# Altium schematic sheet SOC Power.SchDoc
size A2; DocumentNumber: 2; SheetNumber: 3; SheetTotal: 14
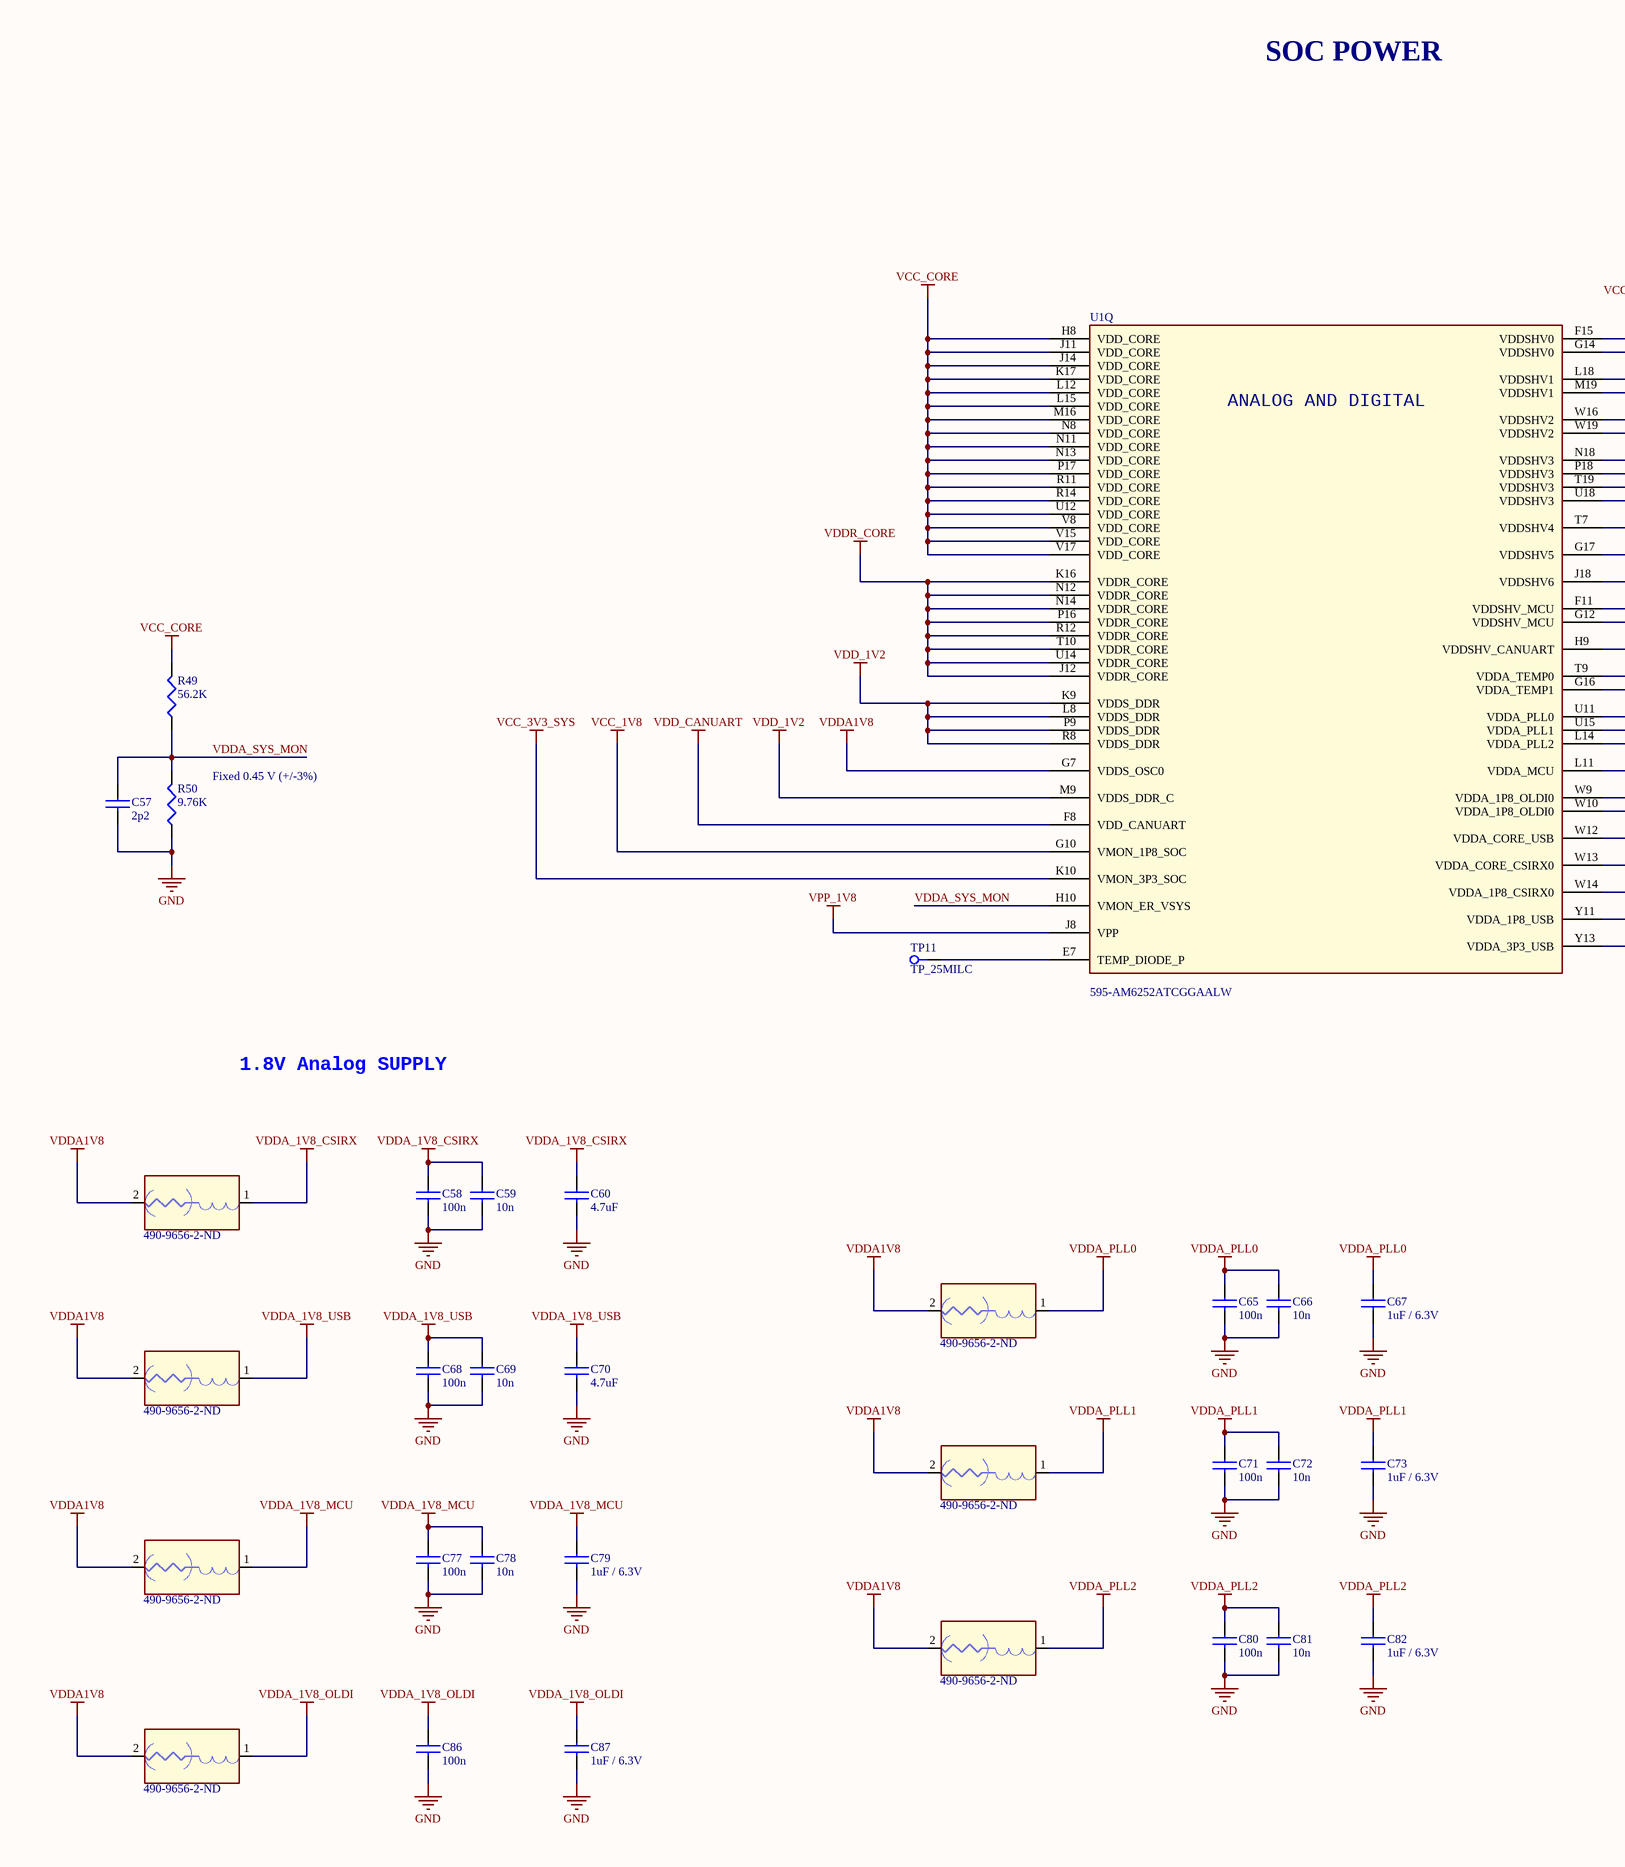
[diagram p0: SOC Power.SchDoc, left]
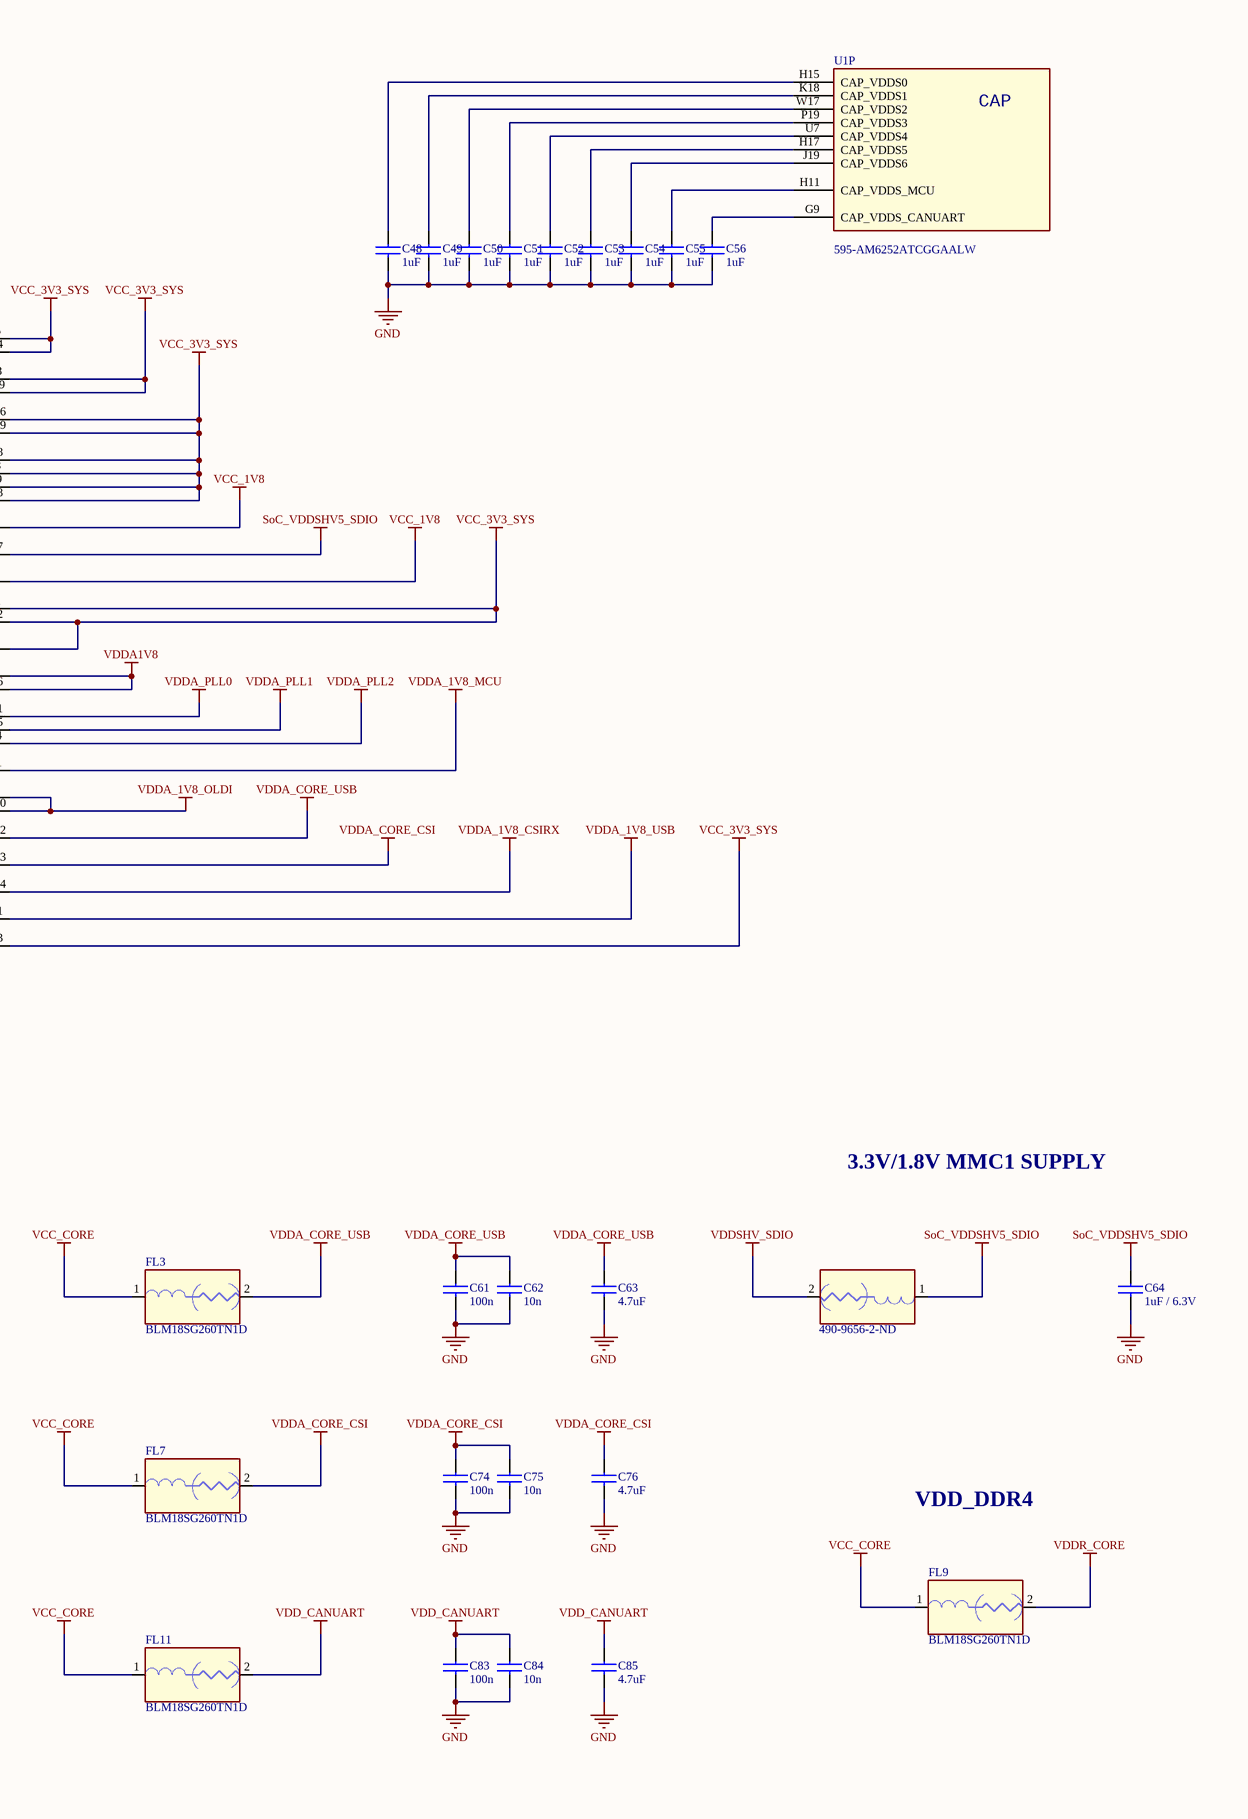
[diagram p1: SOC Power.SchDoc, right]

## Parts
C48  1uF  [C0201]
C49  1uF  [C0201]
C50  1uF  [C0201]
C51  1uF  [C0201]
C52  1uF  [C0201]
C53  1uF  [C0201]
C54  1uF  [C0201]
C55  1uF  [C0201]
C56  1uF  [C0201]
C57  2p2  [C0201]
C58  100n  [C0201]
C59  10n  [C0201]
C60  4.7uF  [C0201]
C61  100n  [C0201]
C62  10n  [C0201]
C63  4.7uF  [C0201]
C64  1uF / 6.3V  [C0201]
C65  100n  [C0201]
C66  10n  [C0201]
C67  1uF / 6.3V  [C0201]
C68  100n  [C0201]
C69  10n  [C0201]
C70  4.7uF  [C0201]
C71  100n  [C0201]
C72  10n  [C0201]
C73  1uF / 6.3V  [C0201]
C74  100n  [C0201]
C75  10n  [C0201]
C76  4.7uF  [C0201]
C77  100n  [C0201]
C78  10n  [C0201]
C79  1uF / 6.3V  [C0201]
C80  100n  [C0201]
C81  10n  [C0201]
C82  1uF / 6.3V  [C0201]
C83  100n  [C0201]
C84  10n  [C0201]
C85  4.7uF  [C0201]
C86  100n  [C0201]
C87  1uF / 6.3V  [C0201]
FL2  Supplier Part Number 1: 490-9656-2-ND  [NFZ15SG152SN10B]  (hidden comment: BLM15PX121SN1D)
FL3  BLM18SG260TN1D  [BLM18EG101TH1D]
FL4  Supplier Part Number 1: 490-9656-2-ND  [NFZ15SG152SN10B]  (hidden comment: BLM15PX121SN1D)
FL5  Supplier Part Number 1: 490-9656-2-ND  [NFZ15SG152SN10B]  (hidden comment: BLM15PX121SN1D)
FL6  Supplier Part Number 1: 490-9656-2-ND  [NFZ15SG152SN10B]  (hidden comment: BLM15PX121SN1D)
FL7  BLM18SG260TN1D  [BLM18EG101TH1D]
FL8  Supplier Part Number 1: 490-9656-2-ND  [NFZ15SG152SN10B]  (hidden comment: BLM15PX121SN1D)
FL9  BLM18SG260TN1D  [BLM18EG101TH1D]
FL10  Supplier Part Number 1: 490-9656-2-ND  [NFZ15SG152SN10B]  (hidden comment: BLM15PX121SN1D)
FL11  BLM18SG260TN1D  [BLM18EG101TH1D]
FL12  Supplier Part Number 1: 490-9656-2-ND  [NFZ15SG152SN10B]  (hidden comment: BLM15PX121SN1D)
FL13  Supplier Part Number 1: 490-9656-2-ND  [NFZ15SG152SN10B]  (hidden comment: BLM15PX121SN1D)
R49  56.2K  [R0201]
R50  9.76K  [R0201]
TP11  TP_25MILC  [TP_25C]  (no BOM)
U1  Supplier Part Number 1: 595-AM6252ATCGGAALW  [BGA425C50P25X25_1300X1300X89]  (hidden comment: AM62-EVM_BGA425)  (parts P,Q of 18)

## Nets
GND: C48.2 C49.2 C50.2 C51.2 C52.2 C53.2 C54.2 C55.2 C56.2 C57.2 C58.2 C59.2 C60.2 C61.2 C62.2 C63.2 C64.2 C65.2 C66.2 C67.2 C68.2 C69.2 C70.2 C71.2 C72.2 C73.2 C74.2 C75.2 C76.2 C77.2 C78.2 C79.2 C80.2 C81.2 C82.2 C83.2 C84.2 C85.2 C86.2 C87.2 R50.1
SoC_VDDSHV5_SDIO: C64.1 FL4.1 U1.G17(VDDSHV5)
VCC_1V8: U1.G10(VMON_1P8_SOC) U1.J18(VDDSHV6) U1.T7(VDDSHV4)
VCC_3V3_SYS: U1.F11(VDDSHV_MCU) U1.F15(VDDSHV0) U1.G12(VDDSHV_MCU) U1.G14(VDDSHV0) U1.H9(VDDSHV_CANUART) U1.K10(VMON_3P3_SOC) U1.L18(VDDSHV1) U1.M19(VDDSHV1) U1.N18(VDDSHV3) U1.P18(VDDSHV3) U1.T19(VDDSHV3) U1.U18(VDDSHV3) U1.W16(VDDSHV2) U1.W19(VDDSHV2) U1.Y13(VDDA_3P3_USB)
VCC_CORE: FL3.1 FL7.1 FL9.1 FL11.1 R49.2 U1.H8(VDD_CORE) U1.J11(VDD_CORE) U1.J14(VDD_CORE) U1.K17(VDD_CORE) U1.L12(VDD_CORE) U1.L15(VDD_CORE) U1.M16(VDD_CORE) U1.N8(VDD_CORE) U1.N11(VDD_CORE) U1.N13(VDD_CORE) U1.P17(VDD_CORE) U1.R11(VDD_CORE) U1.R14(VDD_CORE) U1.U12(VDD_CORE) U1.V8(VDD_CORE) U1.V15(VDD_CORE) U1.V17(VDD_CORE)
VDD_1V2: U1.K9(VDDS_DDR) U1.L8(VDDS_DDR) U1.M9(VDDS_DDR_C) U1.P9(VDDS_DDR) U1.R8(VDDS_DDR)
VDD_CANUART: C83.1 C84.1 C85.1 FL11.2 U1.F8(VDD_CANUART)
VDDA1V8: FL2.2 FL5.2 FL6.2 FL8.2 FL10.2 FL12.2 FL13.2 U1.G7(VDDS_OSC0) U1.G16(VDDA_TEMP1) U1.T9(VDDA_TEMP0)
VDDA_1V8_CSIRX: C58.1 C59.1 C60.1 FL2.1 U1.W14(VDDA_1P8_CSIRX0)
VDDA_1V8_MCU: C77.1 C78.1 C79.1 FL10.1 U1.L11(VDDA_MCU)
VDDA_1V8_OLDI: C86.1 C87.1 FL13.1 U1.W9(VDDA_1P8_OLDI0) U1.W10(VDDA_1P8_OLDI0)
VDDA_1V8_USB: C68.1 C69.1 C70.1 FL6.1 U1.Y11(VDDA_1P8_USB)
VDDA_CORE_CSI: C74.1 C75.1 C76.1 FL7.2 U1.W13(VDDA_CORE_CSIRX0)
VDDA_CORE_USB: C61.1 C62.1 C63.1 FL3.2 U1.W12(VDDA_CORE_USB)
VDDA_PLL0: C65.1 C66.1 C67.1 FL5.1 U1.U11(VDDA_PLL0)
VDDA_PLL1: C71.1 C72.1 C73.1 FL8.1 U1.U15(VDDA_PLL1)
VDDA_PLL2: C80.1 C81.1 C82.1 FL12.1 U1.L14(VDDA_PLL2)
VDDR_CORE: FL9.2 U1.J12(VDDR_CORE) U1.K16(VDDR_CORE) U1.N12(VDDR_CORE) U1.N14(VDDR_CORE) U1.P16(VDDR_CORE) U1.R12(VDDR_CORE) U1.T10(VDDR_CORE) U1.U14(VDDR_CORE)
VDDSHV_SDIO: FL4.2
VPP_1V8: U1.J8(VPP)
VDDA_SYS_MON: C57.1 R49.1 R50.2 U1.H10(VMON_ER_VSYS)
NetC48_1: C48.1 U1.H15(CAP_VDDS0)
NetC49_1: C49.1 U1.K18(CAP_VDDS1)
NetC50_1: C50.1 U1.W17(CAP_VDDS2)
NetC51_1: C51.1 U1.P19(CAP_VDDS3)
NetC52_1: C52.1 U1.U7(CAP_VDDS4)
NetC53_1: C53.1 U1.H17(CAP_VDDS5)
NetC54_1: C54.1 U1.J19(CAP_VDDS6)
NetC55_1: C55.1 U1.H11(CAP_VDDS_MCU)
NetC56_1: C56.1 U1.G9(CAP_VDDS_CANUART)
NetTP11_1: TP11.1 U1.E7(TEMP_DIODE_P)

## Notes on the sheet
- SOC POWER
- (near R50) Fixed 0.45 V (+/-3%)
- 1.8V Analog SUPPLY
- 3.3V/1.8V MMC1 SUPPLY
- VDD_DDR4
- (in symbol AM62-EVM_BGA425, part P) CAP
- (in symbol AM62-EVM_BGA425, part Q) ANALOG AND DIGITAL

## Library data of the parts
C48-C56 C64 C67 C73 C79 C82 C87 = CL03A105KQ3CSNC: CAP CER 1UF 6.3V X5R 0201; Manufacturer: Samsung; Tolerance: 10%; Supplier 1: Digi-Key; Manufacturer Part Number: CL03A105KQ3CSNC; Stock 1: 1049900; Pricing 1: 10000=0.0226, 20000=0.0215, 30000=0.0204, 50000=0.0187, 100000=0.0154, 250000=0.0141 (USD); Mount: Surface Mount; Case/Package: 0201; Case Code (Metric): 0603; Case Code (Imperial): 0201; Contact Plating: Tin; Min Operating Temperature: -55°C; Max Operating Temperature: 85°C; Capacitance: 1uF; Packaging: Tape and Reel; Voltage Rating: 6.3V; Dielectric: X5R; Series: CL; Construction: Flat; Length: 0.6mm; Width: 0.012inch; Height: 0.3mm; Thickness: 0.013inch; Depth: 0.3mm; Radiation Hardening: No; RoHS Compliant: Yes; ComponentLink1URL: https://datasheet.ciiva.com/18699/cl03a105kq3csnc-18699129.pdf?src-supplier=Digi-Key; ComponentLink1Description: https://datasheet.ciiva.com/18699/cl03a105kq3csnc-18699129.pdf?src-supplier=Digi-Key; ComponentLink2URL: https://datasheet.ciiva.com/26838/getdatasheetpartid-355153-26838086.pdf?src-supplier=Verical; ComponentLink2Description: https://datasheet.ciiva.com/26838/getdatasheetpartid-355153-26838086.pdf?src-supplier=Verical; Supplier Part Number 1: 1276-1323-2-ND
C57 = C0603C0G1H2R2C030BA: CAP CER 2.2PF 50V C0G 0201; Manufacturer: TDK Corporation; Tolerance: ±0.25pF; Temperature Coefficient: C0G, NP0; .Checked PCB: MM; Supplier 1: Digi-Key; Manufacturer Part Number: C0603C0G1H2R2C030BA; RoHS: RoHS Compliant; Category: Capacitors; Stock 1: 90496; Pricing 1: 1=0.1, 10=0.027, 100=0.0123, 250=0.01008, 500=0.00864, 1000=0.0066, 5000=0.0055 (USD); Packaging: Cut Tape (CT); Capacitance: 2.2pF; Voltage - Rated: 50V; Mounting Type: Surface Mount, MLCC; Operating Temperature: -55°C ~ 125°C; Applications: General Purpose; Ratings: -; Package / Case: 0201 (0603 Metric); Size / Dimension: 0.024" L x 0.012" W (0.60mm x 0.30mm); Height - Seated (Max): -; Thickness (Max): 0.013" (0.33mm); Lead Spacing: -; Features: -; Lead Style: -; ComponentLink1URL: http://product.tdk.com/en/catalog/datasheets/mlcc_commercial_general_en.pdf; ComponentLink1Description: http://product.tdk.com/en/catalog/datasheets/mlcc_commercial_general_en.pdf; Supplier Part Number 1: 445-1771-1-ND; .Checked SCH: MM; .Creator: MM
C58 C61 C65 C68 C71 C74 C77 C80 C83 C86 = C0603X5R1C104K030BC: CAP CER 0.1UF 16V 10% X5R 0201; Manufacturer: TDK Corporation; Capacitance: 0.1µF; .Creator: MM; Supplier 1: Digi-Key; Manufacturer Part Number: C0603X5R1C104K030BC; RoHS: RoHS Compliant; Category: Capacitors; Stock 1: 19491; Pricing 1: 1=0.1, 10=0.046, 100=0.0209, 250=0.01712, 500=0.01464, 1000=0.0114, 5000=0.0095 (USD); Packaging: Cut Tape (CT); Tolerance: ±10%; Voltage - Rated: 16V; Temperature Coefficient: X5R; Mounting Type: Surface Mount, MLCC; Operating Temperature: -55°C ~ 85°C; Applications: General Purpose; Ratings: -; Package / Case: 0201 (0603 Metric); Size / Dimension: 0.024" L x 0.012" W (0.60mm x 0.30mm); Height - Seated (Max): -; Thickness (Max): 0.013" (0.33mm); Lead Spacing: -; Features: -; Lead Style: -; ComponentLink1URL: http://product.tdk.com/en/catalog/datasheets/mlcc_commercial_general_en.pdf; ComponentLink1Description: http://product.tdk.com/en/catalog/datasheets/mlcc_commercial_general_en.pdf; Supplier Part Number 1: 445-7313-1-ND; .Checked PCB: MM; .Checked SCH: MM
C59 C62 C66 C69 C72 C75 C78 C81 C84 = C0603X5R1C103K030BA: CAP CER .01UF 16V 10% X5R 0201; Manufacturer: TDK Corporation; Capacitance: 10000pF; .Creator: MM; Supplier 1: Digi-Key; Manufacturer Part Number: C0603X5R1C103K030BA; RoHS: RoHS Compliant; Category: Capacitors; Stock 1: 24793; Pricing 1: 1=0.1, 10=0.043, 100=0.0196, 250=0.01608, 500=0.01374, 1000=0.0105, 5000=0.00875 (USD); Packaging: Cut Tape (CT); Tolerance: ±10%; Voltage - Rated: 16V; Temperature Coefficient: X5R; Mounting Type: Surface Mount, MLCC; Operating Temperature: -55°C ~ 85°C; Applications: General Purpose; Ratings: -; Package / Case: 0201 (0603 Metric); Size / Dimension: 0.024" L x 0.012" W (0.60mm x 0.30mm); Height - Seated (Max): -; Thickness (Max): 0.013" (0.33mm); Lead Spacing: -; Features: -; Lead Style: -; ComponentLink1URL: http://product.tdk.com/en/catalog/datasheets/mlcc_commercial_general_en.pdf; ComponentLink1Description: http://product.tdk.com/en/catalog/datasheets/mlcc_commercial_general_en.pdf; Supplier Part Number 1: 445-16166-1-ND; .Checked PCB: MM; .Checked SCH: MM
C60 C63 C70 C76 C85 = GRM035R60J475ME15D: CAP CER 4.7UF 6.3V X5R 0201; Manufacturer: Murata; Tolerance: 20%; Supplier 1: Digi-Key; Manufacturer Part Number: GRM035R60J475ME15D; Stock 1: 1730472; Pricing 1: 10000=0.044, 50000=0.0377, 100000=0.0333, 250000=0.0331 (USD); Mount: Surface Mount; Case/Package: 0201; Case Code (Metric): 0603; Case Code (Imperial): 0201; Min Operating Temperature: -55°C; Max Operating Temperature: 85°C; Packaging: Cut Tape; Series: GRM; Capacitance: 4.7uF; Voltage Rating: 6.3V; Voltage Rating (DC): 6.3V; Dielectric: X5R; Length: 0.024inch; Width: 0.012inch; Thickness: 0.022inch; RoHS Compliant: Yes; ComponentLink1URL: https://datasheet.octopart.com/GRM035R60J475ME15D-Murata-datasheet-140089765.pdf?src-supplier=Future+Electronics; ComponentLink1Description: https://datasheet.octopart.com/GRM035R60J475ME15D-Murata-datasheet-140089765.pdf?src-supplier=Future+Electronics; ComponentLink2URL: http://www.farnell.com/datasheets/2853106.pdf?src-supplier=Farnell; ComponentLink2Description: http://www.farnell.com/datasheets/2853106.pdf?src-supplier=Farnell; ComponentLink3URL: http://www.farnell.com/datasheets/2853106.pdf?src-supplier=Newark; ComponentLink3Description: http://www.farnell.com/datasheets/2853106.pdf?src-supplier=Newark; ComponentLink4URL: https://datasheet.octopart.com/GRM035R60J475ME15D-Murata-datasheet-149522819.pdf?src-supplier=Farnell; ComponentLink4Description: https://datasheet.octopart.com/GRM035R60J475ME15D-Murata-datasheet-149522819.pdf?src-supplier=Farnell; ComponentLink5URL: http://search.murata.co.jp/Ceramy/image/img/A01X/G101/ENG/GRM035R60J475ME15-01.pdf?src-supplier=Digi-Key; ComponentLink5Description: http://search.murata.co.jp/Ceramy/image/img/A01X/G101/ENG/GRM035R60J475ME15-01.pdf?src-supplier=Digi-Key; ComponentLink6URL: https://datasheet.octopart.com/GRM035R60J475ME15D-Murata-datasheet-165579666.pdf?src-supplier=TME; ComponentLink6Description: https://datasheet.octopart.com/GRM035R60J475ME15D-Murata-datasheet-165579666.pdf?src-supplier=TME; Supplier Part Number 1: 490-13230-2-ND
FL2 FL4-FL6 FL8 FL10 FL12 FL13 = BLM15PX121SN1D: FERRITE BEAD 120 OHM 0402 1LN; Manufacturer: Murata; Tolerance: 25%; Impedance: 120R; Current Rating: 2A; Number of Lines: 1; DC Resistance (DCR): 55mR; Test Frequency: 100MHz; Supplier 1: Digi-Key; Manufacturer Part Number: BLM15PX121SN1D; Stock 1: 490000; Pricing 1: 10000=0.0196 (USD); Case/Package: 0402; Number of Pins: 2; Case Code (Metric): 1005; Case Code (Imperial): 0402; Weight: 2.3E-05oz; Material: Steel; Min Operating Temperature: -55°C; Max Operating Temperature: 125°C; Package Quantity: 1; Packaging: Tape and Reel; Max Current Rating: 2A; Termination: SMD/SMT; Max DC Current: 2A; Number of Circuits: 1; Series: EMIFIL®, BLM15P; Length: 1mm; Width: 0.5mm; Height: 0.5mm; Reach SVHC Compliant: Yes; Lead Free: Lead Free; RoHS Compliant: Yes; ComponentLink1URL: https://datasheet.ciiva.com/41449/001172210-da-01-en-drossel-0402-120r-1-0x0-5mm-10000st-41449498.pdf?src-supplier=Conrad; ComponentLink1Description: https://datasheet.ciiva.com/41449/001172210-da-01-en-drossel-0402-120r-1-0x0-5mm-10000st-41449498.pdf?src-supplier=Conrad; ComponentLink2URL: https://datasheet.ciiva.com/41860/l0110e-41860699.pdf?src-supplier=Digi-Key; ComponentLink2Description: https://datasheet.ciiva.com/41860/l0110e-41860699.pdf?src-supplier=Digi-Key; ComponentLink3URL: https://datasheet.ciiva.com/29364/l0110e-29364069.pdf?src-supplier=Digi-Key; ComponentLink3Description: https://datasheet.ciiva.com/29364/l0110e-29364069.pdf?src-supplier=Digi-Key
FL3 FL7 FL9 FL11 = BLM18SG260TN1D: FERRITE BEAD 26 OHM 0603 1LN; Manufacturer: Murata; Impedance: 26R; Tolerance: 25%; Current Rating: 6A; Number of Lines: 1; DC Resistance (DCR): 7mR; Test Frequency: 100MHz; Supplier 1: Digi-Key; Manufacturer Part Number: BLM18SG260TN1D; Stock 1: 170000; Pricing 1: 10000=0.032, 20000=0.0305, 30000=0.0297 (USD); Case/Package: 0603; Number of Pins: 2; Core Material: Ferrite; Case Code (Metric): 1608; Case Code (Imperial): 0603; Material: Steel,Ferrite; Min Operating Temperature: -55°C; Max Operating Temperature: 125°C; Package Quantity: 1; Packaging: Tape and Reel; Max Current Rating: 6A; Termination: SMD/SMT; Max DC Current: 6A; DC Current: 6A; Frequency: 100MHz; Number of Circuits: 1; Series: BLM18S; DC Resistance-Max: 7mR; Length: 1.6mm; Width: 0.8mm; Height: 0.8mm; Depth: 0.8mm; Radiation Hardening: No; Reach SVHC Compliant: Yes; Military Standard: Not; Lead Free: Lead Free; RoHS Compliant: Yes; ComponentLink1URL: https://datasheet.ciiva.com/5709/5151-5709200.pdf?src-supplier=Farnell; ComponentLink1Description: https://datasheet.ciiva.com/5709/5151-5709200.pdf?src-supplier=Farnell; ComponentLink2URL: https://datasheet.ciiva.com/18183/getdatasheetpartid-243591-18183212.pdf?src-supplier=Verical; ComponentLink2Description: https://datasheet.ciiva.com/18183/getdatasheetpartid-243591-18183212.pdf?src-supplier=Verical; ComponentLink3URL: https://datasheet.ciiva.com/41449/001171725-da-01-en-chip-drossel0603-26r-6000ma-1-6x0-8mm-41449354.pdf?src-supplier=Conrad; ComponentLink3Description: https://datasheet.ciiva.com/41449/001171725-da-01-en-chip-drossel0603-26r-6000ma-1-6x0-8mm-41449354.pdf?src-supplier=Conrad; ComponentLink4URL: https://datasheet.ciiva.com/41449/001172314-da-01-en-drossel-0603-26r-1-6x0-8mm-10000st-41449676.pdf?src-supplier=Conrad; ComponentLink4Description: https://datasheet.ciiva.com/41449/001172314-da-01-en-drossel-0603-26r-1-6x0-8mm-10000st-41449676.pdf?src-supplier=Conrad; ComponentLink5URL: https://datasheet.ciiva.com/6212/l0110s0100blm18s-6212362.pdf?src-supplier=Digi-Key; ComponentLink5Description: https://datasheet.ciiva.com/6212/l0110s0100blm18s-6212362.pdf?src-supplier=Digi-Key; Supplier Part Number 1: 490-3995-2-ND
R49 = RC0201FR-0756K2L: RES 56.2K OHM 1% 1/20W 0201; Manufacturer: Yageo; Resistance: 56.2kR; Max Power Dissipation: 50mW; Temperature Coefficient: 200ppm/°C; Supplier 1: Digi-Key; Manufacturer Part Number: RC0201FR-0756K2L; Stock 1: 241829; Pricing 1: 1=0.1, 10=0.026, 50=0.0162, 100=0.0136, 500=0.0094, 1000=0.0081, 5000=0.006 (USD); Case/Package: 0201; Case Code (Metric): 0603; Case Code (Imperial): 0201; Min Operating Temperature: -55°C; Max Operating Temperature: 125°C; Tolerance: 1%; Packaging: Cut Tape; Resistor Type: Thick Film; Number of Terminations: 2; Features: Moisture Resistant; Series: RC; Length: 0.024inch; Width: 0.012inch; Height: 0.01inch; Depth: 0.3mm; Military Standard: Not; RoHS Compliant: Yes; ComponentLink1URL: https://datasheet.octopart.com/RC0201FR-0756K2L-Yageo-datasheet-164759695.pdf?src-supplier=Future+Electronics; ComponentLink1Description: https://datasheet.octopart.com/RC0201FR-0756K2L-Yageo-datasheet-164759695.pdf?src-supplier=Future+Electronics; ComponentLink2URL: http://www.yageo.com/documents/recent/PYu-RC_Group_51_RoHS_L_10.pdf?src-supplier=Digi-Key; ComponentLink2Description: http://www.yageo.com/documents/recent/PYu-RC_Group_51_RoHS_L_10.pdf?src-supplier=Digi-Key; ComponentLink3URL: https://www.yageo.com/upload/media/product/productsearch/datasheet/rchip/PYu-RC_Group_51_RoHS_L_11.pdf?src-supplier=Digi-Key; ComponentLink3Description: https://www.yageo.com/upload/media/product/productsearch/datasheet/rchip/PYu-RC_Group_51_RoHS_L_11.pdf?src-supplier=Digi-Key; ComponentLink4URL: http://www.yageo.com/documents/recent/PYu-RC_Group_51_RoHS_L_9.pdf?src-supplier=Digi-Key; ComponentLink4Description: http://www.yageo.com/documents/recent/PYu-RC_Group_51_RoHS_L_9.pdf?src-supplier=Digi-Key; Supplier Part Number 1: YAG2731DKR-ND
R50 = RC0201FR-079K76L: RES 9.76K OHM 1% 1/20W 0201; Manufacturer: Yageo; Resistance: 9.76kR; Max Power Dissipation: 50mW; Temperature Coefficient: 200ppm/°C; Supplier 1: Digi-Key; Manufacturer Part Number: RC0201FR-079K76L; Stock 1: 0; Pricing 1: 10000=0.0053, 20000=0.0048, 30000=0.0045, 50000=0.0042, 100000=0.0038 (USD); Case/Package: 0201; Case Code (Metric): 0603; Case Code (Imperial): 0201; Min Operating Temperature: -55°C; Max Operating Temperature: 125°C; Packaging: Cut Tape; Resistor Type: Thick Film; Number of Terminations: 2; Tolerance: 1%; Features: Moisture Resistant; Series: RC; Length: 0.024inch; Width: 0.012inch; Height: 0.01inch; RoHS Compliant: Yes; ComponentLink1URL: http://www.yageo.com/documents/recent/PYu-RC_Group_51_RoHS_L_9.pdf?src-supplier=Digi-Key; ComponentLink1Description: http://www.yageo.com/documents/recent/PYu-RC_Group_51_RoHS_L_9.pdf?src-supplier=Digi-Key; ComponentLink2URL: https://www.yageo.com/upload/media/product/productsearch/datasheet/rchip/PYu-RC_Group_51_RoHS_L_10.pdf?src-supplier=Digi-Key; ComponentLink2Description: https://www.yageo.com/upload/media/product/productsearch/datasheet/rchip/PYu-RC_Group_51_RoHS_L_10.pdf?src-supplier=Digi-Key; Supplier Part Number 1: YAG2860TR-ND
TP11 = TP_25MILC: Test Point 25mil
U1 = AM62-EVM_BGA425: ARM® Cortex®-A53 Microprocessor IC Sitara™ 2 Core, 64-Bit 1.4GHz 425-FCCSP (13x13); Manufacturer: Texas Instruments; Manufacturer Part Number: AM6252ATCGGAALW; Supplier 1: Mouser; Stock 1: 0; Pricing 1: 1=21.23, 10=19.58, 50=18.7, 100=18.7, 1000=15.94, 10000=15.94 (USD)